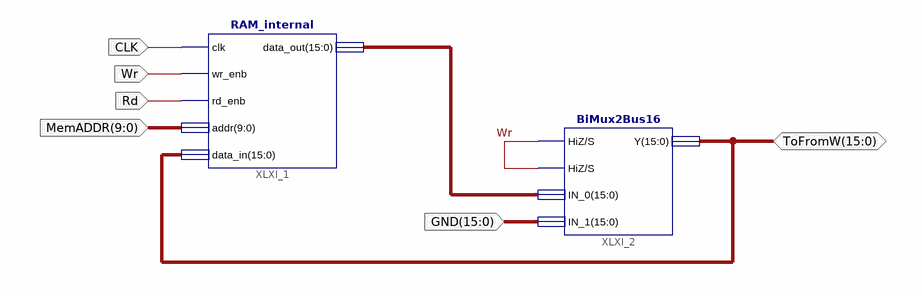
[diagram p0: schematic sheet 1]
// Xilinx ISE schematic RAM_main.sch (artix7) as structural Verilog: 2 symbols, 6 ports
module RAM_main (
  input  CLK,
  input  Wr,
  input  Rd,
  input  [9:0] MemADDR,
  input  [15:0] GND,
  inout  [15:0] ToFromW
);

  wire [15:0] XLXN_23;

  RAM_internal XLXI_1 (.clk(CLK), .wr_enb(Wr), .rd_enb(Rd), .addr(MemADDR), .data_in(ToFromW), .data_out(XLXN_23));
  BiMux2Bus16 XLXI_2 (.HiZ(Wr), .S(Wr), .IN_0(XLXN_23), .IN_1(GND), .Y(ToFromW));
endmodule
